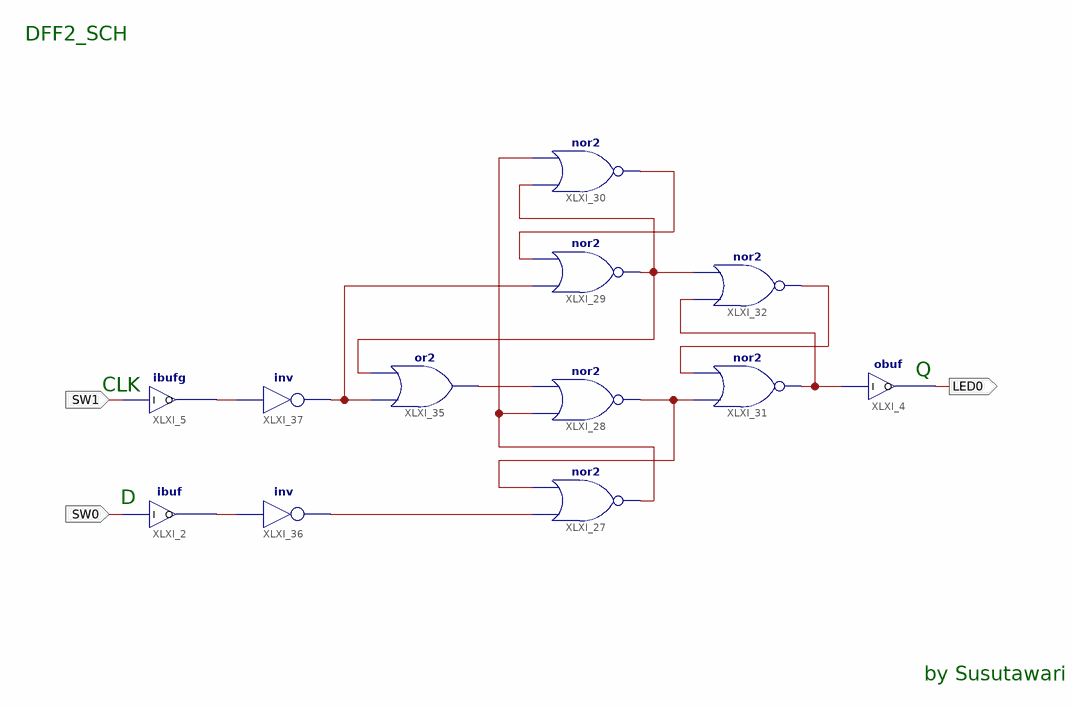
[diagram p0: schematic sheet 1]
// Xilinx ISE schematic DFF2_SCH.sch (spartan3e) as structural Verilog: 12 symbols, 3 ports
module DFF2_SCH (
  input  SW1,
  input  SW0,
  output LED0
);

  wire XLXN_1, XLXN_2, XLXN_8, XLXN_9, XLXN_15, XLXN_31, XLXN_35, XLXN_36, XLXN_91, XLXN_94, XLXN_118;

  nor XLXI_30 (XLXN_8, XLXN_9, XLXN_35);
  nor XLXI_29 (XLXN_9, XLXN_2, XLXN_8);
  nor XLXI_28 (XLXN_31, XLXN_35, XLXN_36);
  nor XLXI_27 (XLXN_35, XLXN_94, XLXN_31);
  not XLXI_36 (XLXN_94, XLXN_1);
  nor XLXI_32 (XLXN_91, XLXN_15, XLXN_9);
  nor XLXI_31 (XLXN_15, XLXN_31, XLXN_91);
  obuf XLXI_4 (.I(XLXN_15), .O(LED0));
  or XLXI_35 (XLXN_36, XLXN_2, XLXN_9);
  not XLXI_37 (XLXN_2, XLXN_118);
  ibufg XLXI_5 (.I(SW1), .O(XLXN_118));
  ibuf XLXI_2 (.I(SW0), .O(XLXN_1));

  // Notes on the sheet:
  //   DFF2_SCH
  //   Q
  //   CLK
  //   D
  //   by Susutawari
endmodule
